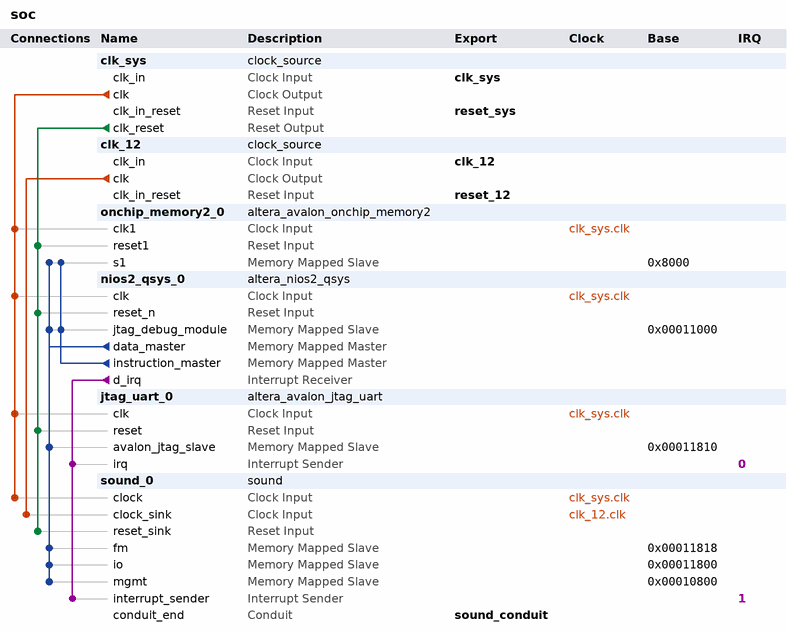
[diagram p0: system contents]
# Platform Designer (Qsys) system soc, Cyclone IV E EP4CE115F29C7
# Parameters at their usual value, and those the tool derives, are not listed.
package require -exact qsys 13.0
create_system soc
set_project_property DEVICE_FAMILY {Cyclone IV E}
set_project_property DEVICE EP4CE115F29C7

add_instance clk_sys clock_source 13.0
set_instance_parameter_value clk_sys clockFrequency 50000000

add_instance clk_12 clock_source 13.0
set_instance_parameter_value clk_12 clockFrequency 12000000

add_instance onchip_memory2_0 altera_avalon_onchip_memory2 13.0.1.99.2
set_instance_parameter_value onchip_memory2_0 dataWidth 32
set_instance_parameter_value onchip_memory2_0 dualPort false
set_instance_parameter_value onchip_memory2_0 initMemContent true
set_instance_parameter_value onchip_memory2_0 initializationFileName onchip_mem.hex
set_instance_parameter_value onchip_memory2_0 memorySize 32768

add_instance nios2_qsys_0 altera_nios2_qsys 13.0
set_instance_parameter_value nios2_qsys_0 resetSlave onchip_memory2_0.s1
set_instance_parameter_value nios2_qsys_0 mmu_TLBMissExcSlave None
set_instance_parameter_value nios2_qsys_0 exceptionSlave onchip_memory2_0.s1
set_instance_parameter_value nios2_qsys_0 breakSlave nios2_qsys_0.jtag_debug_module
set_instance_parameter_value nios2_qsys_0 impl Tiny
set_instance_parameter_value nios2_qsys_0 icache_size 4096

add_instance jtag_uart_0 altera_avalon_jtag_uart 13.0.1.99.2
set_instance_parameter_value jtag_uart_0 simInteractiveOptions NO_INTERACTIVE_WINDOWS

add_instance sound_0 sound 1.0

# connections
add_connection clk_12.clk sound_0.clock_sink clock
add_connection clk_sys.clk jtag_uart_0.clk clock
add_connection clk_sys.clk nios2_qsys_0.clk clock
add_connection clk_sys.clk onchip_memory2_0.clk1 clock
add_connection clk_sys.clk sound_0.clock clock
add_connection clk_sys.clk_reset jtag_uart_0.reset reset
add_connection clk_sys.clk_reset nios2_qsys_0.reset_n reset
add_connection clk_sys.clk_reset onchip_memory2_0.reset1 reset
add_connection clk_sys.clk_reset sound_0.reset_sink reset
add_connection nios2_qsys_0.data_master jtag_uart_0.avalon_jtag_slave avalon
set_connection_parameter_value nios2_qsys_0.data_master/jtag_uart_0.avalon_jtag_slave baseAddress 0x00011810
add_connection nios2_qsys_0.data_master nios2_qsys_0.jtag_debug_module avalon
set_connection_parameter_value nios2_qsys_0.data_master/nios2_qsys_0.jtag_debug_module baseAddress 0x00011000
add_connection nios2_qsys_0.data_master onchip_memory2_0.s1 avalon
set_connection_parameter_value nios2_qsys_0.data_master/onchip_memory2_0.s1 baseAddress 0x8000
add_connection nios2_qsys_0.data_master sound_0.fm avalon
set_connection_parameter_value nios2_qsys_0.data_master/sound_0.fm baseAddress 0x00011818
add_connection nios2_qsys_0.data_master sound_0.io avalon
set_connection_parameter_value nios2_qsys_0.data_master/sound_0.io baseAddress 0x00011800
add_connection nios2_qsys_0.data_master sound_0.mgmt avalon
set_connection_parameter_value nios2_qsys_0.data_master/sound_0.mgmt baseAddress 0x00010800
add_connection nios2_qsys_0.instruction_master nios2_qsys_0.jtag_debug_module avalon
set_connection_parameter_value nios2_qsys_0.instruction_master/nios2_qsys_0.jtag_debug_module baseAddress 0x00011000
add_connection nios2_qsys_0.instruction_master onchip_memory2_0.s1 avalon
set_connection_parameter_value nios2_qsys_0.instruction_master/onchip_memory2_0.s1 baseAddress 0x8000
add_connection nios2_qsys_0.d_irq jtag_uart_0.irq interrupt
set_connection_parameter_value nios2_qsys_0.d_irq/jtag_uart_0.irq irqNumber 0
add_connection nios2_qsys_0.d_irq sound_0.interrupt_sender interrupt
set_connection_parameter_value nios2_qsys_0.d_irq/sound_0.interrupt_sender irqNumber 1

# exported interfaces
add_interface clk_sys clock sink
set_interface_property clk_sys EXPORT_OF clk_sys.clk_in
add_interface reset_sys reset sink
set_interface_property reset_sys EXPORT_OF clk_sys.clk_in_reset
add_interface clk_12 clock sink
set_interface_property clk_12 EXPORT_OF clk_12.clk_in
add_interface reset_12 reset sink
set_interface_property reset_12 EXPORT_OF clk_12.clk_in_reset
add_interface sound_conduit conduit end
set_interface_property sound_conduit EXPORT_OF sound_0.conduit_end

set_interconnect_requirement {$system} qsys_mm.clockCrossingAdapter HANDSHAKE
set_interconnect_requirement {$system} qsys_mm.maxAdditionalLatency 1

save_system soc.qsys
